# Altium schematic sheet Conning_Tower.SchDoc
size Tabloid; Organization: Altium Limited; Address1: L3, 12a Rodborough Rd; Address2: Frenchs Forest; Address3: NSW; Address4: Australia 2086
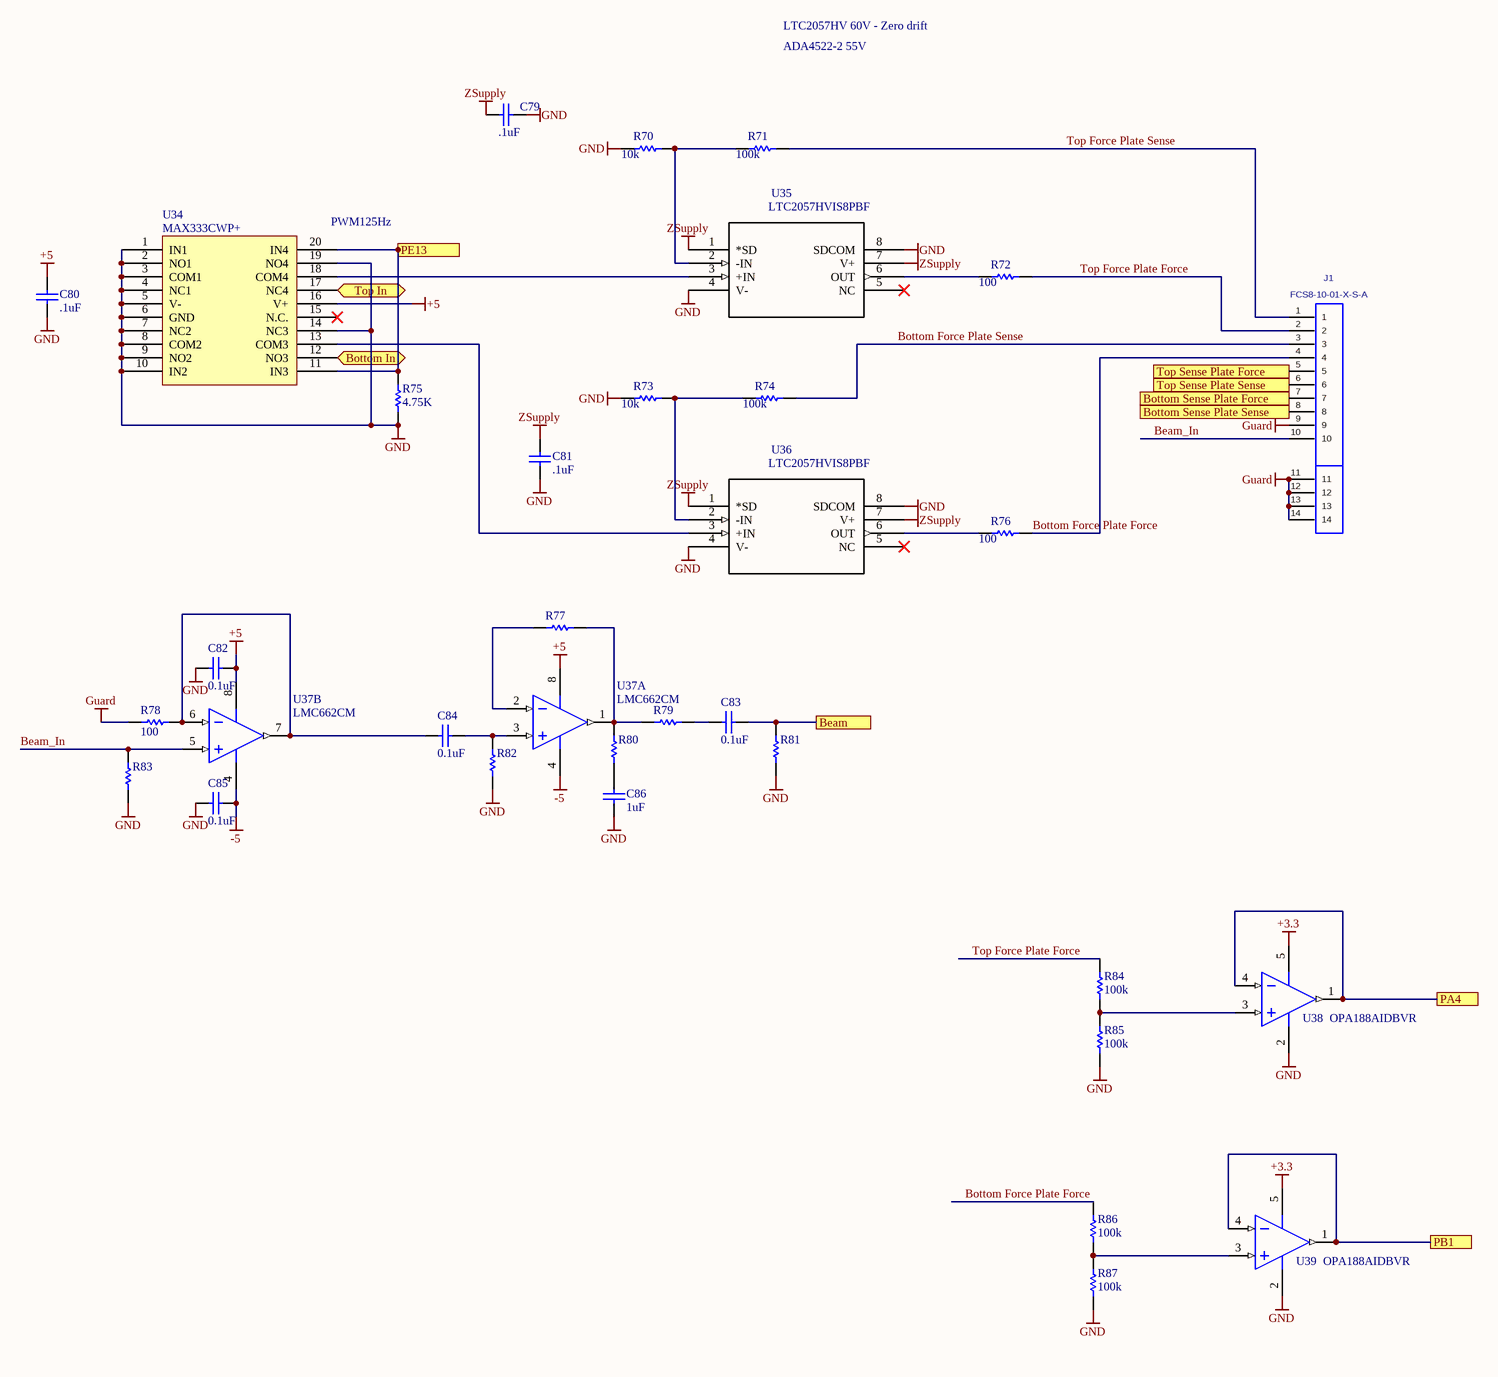
[diagram p0: Conning_Tower.SchDoc]

## Parts
C79  .1uF  [CAPC0805(2012)75_M]
C80  .1uF  [CAPC0805(2012)75_L]
C81  .1uF  [CAPC0805(2012)75_M]
C82  0.1uF  [CAPC0402(1005)60_L]
C83  0.1uF  [CAPC0402(1005)60_L]
C84  0.1uF  [CAPC0402(1005)60_L]
C85  0.1uF  [CAPC0402(1005)60_L]
C86  1uF  [CAPC0402(1005)60_L]
J1  FCS8-10-01-X-S-A  [FCS8-10-01-X-S-A]
R70  value 10k  [RESC0402(1005)_M]  (hidden comment: 10k 1% 0402(1005))
R71  value 100k  [RESC0402(1005)_M]  (hidden comment: 100k 1% 0402(1005))
R72  value 100  [RESC0402(1005)_M]  (hidden comment: 100 1% 0402(1005))
R73  value 10k  [RESC0402(1005)_M]  (hidden comment: 10k 1% 0402(1005))
R74  value 100k  [RESC0402(1005)_M]  (hidden comment: 100k 1% 0402(1005))
R75  4.75K  [RESC0805(2012)_L]
R76  value 100  [RESC0402(1005)_M]  (hidden comment: 100 1% 0402(1005))
R77  (no value)  [RESC0402(1005)_M]
R78  100  [RESC0402(1005)_M]
R79  (no value)  [RESC0402(1005)_M]
R80  (no value)  [RESC0402(1005)_M]
R81  (no value)  [RESC0402(1005)_M]
R82  (no value)  [RESC0402(1005)_M]
R83  (no value)  [RESC0402(1005)_M]
R84  value 100k  [RESC0402(1005)_M]  (hidden comment: 100k 1% 0402(1005))
R85  value 100k  [RESC0402(1005)_M]  (hidden comment: 100k 1% 0402(1005))
R86  value 100k  [RESC0402(1005)_M]  (hidden comment: 100k 1% 0402(1005))
R87  value 100k  [RESC0402(1005)_M]  (hidden comment: 100k 1% 0402(1005))
U34  MAX333CWP+  [TSOP65P640X90-20N]
U35  LTC2057HVIS8PBF  [*SO-8_S]
U36  LTC2057HVIS8PBF  [*SO-8_S]
U37  LMC662CM  [D0008A_M]  (parts A,B of 2)
U38  OPA188AIDBVR  [DBV0005A_M]
U39  OPA188AIDBVR  [DBV0005A_M]

## Ports
Beam, Bottom In (bidir), Bottom Sense Plate Force, Bottom Sense Plate Sense, PA4, PB1, PE13, Top In (bidir), Top Sense Plate Force, Top Sense Plate Sense

## Nets
+3.3: U38.5(V+) U39.5(V+)
+5: C80.2 C82.2 U34.16(V+) U37.8(V+)
-5: C85.2 U37.4(V-)
GND: C79.2 C80.1 C81.1 C82.1 C85.1 C86.1 R70.1 R73.1 R75.2 R81.2 R82.2 R83.1 R85.1 R87.1 U34.1(IN1) U34.2(NO1) U34.3(COM1) U34.4(NC1) U34.5(V-) U34.6(GND) U34.7(NC2) U34.8(COM2) U34.9(NO2) U34.10(IN2) U34.14(NC3) U34.19(NO4) U35.4(V-) U35.8(SDCOM) U36.4(V-) U36.8(SDCOM) U38.2(V-) U39.2(V-)
Guard: J1.9 J1.11 J1.12 J1.13 J1.14 R78.2
ZSupply: C79.1 C81.2 U35.1(*SD) U35.7(V+) U36.1(*SD) U36.7(V+)
Beam: C83.2 R81.1 ; port Beam
Beam_In: J1.10 R83.2 U37.5(INB+)
Bottom Force Plate Force: J1.4 R76.2 R86.2
Bottom Force Plate Sense: J1.3 R74.2
Bottom In: U34.12(NO3) ; port Bottom In
Bottom Sense Plate Force: J1.7 ; port Bottom Sense Plate Force
Bottom Sense Plate Sense: J1.8 ; port Bottom Sense Plate Sense
PA4: U38.1(OUT) U38.4(IN-) ; port PA4
PB1: U39.1(OUT) U39.4(IN-) ; port PB1
PE13: R75.1 U34.11(IN3) U34.20(IN4) ; port PE13
Top Force Plate Force: J1.2 R72.2 R84.2
Top Force Plate Sense: J1.1 R71.2
Top In: U34.17(NC4) ; port Top In
Top Sense Plate Force: J1.5 ; port Top Sense Plate Force
Top Sense Plate Sense: J1.6 ; port Top Sense Plate Sense
NetC83_1: C83.1 R79.1
NetC84_1: C84.1 R78.1 U37.6(INB-) U37.7(OUTB)
NetC84_2: C84.2 R82.1 U37.3(INA+)
NetC86_2: C86.2 R80.2
NetR70_2: R70.2 R71.1 U35.2(-IN)
NetR72_1: R72.1 U35.6(OUT)
NetR73_2: R73.2 R74.1 U36.2(-IN)
NetR76_1: R76.1 U36.6(OUT)
NetR77_1: R77.1 R79.2 R80.1 U37.1(OUTA)
NetR77_2: R77.2 U37.2(INA-)
NetR84_1: R84.1 R85.2 U38.3(IN+)
NetR86_1: R86.1 R87.2 U39.3(IN+)
NetU34_13: U34.13(COM3) U36.3(+IN)
NetU34_18: U34.18(COM4) U35.3(+IN)

Not connected (* = marked no-connect by the designer): U34 15(N.C.)*; U35 5(NC)*; U36 5(NC)*

## Notes on the sheet
- LTC2057HV 60V - Zero drift
- ADA4522-2 55V
- (near U34) PWM125Hz
- Title
- Size:
- Date:
- Tabloid
- Number:
- Time:
- Revision:
- Sheet
- of
- File:

## Library data of the parts
C79 C81 = CMP-1036-01414-1: CAP 33pF 25V ±2% 0805 (2012 Metric) Thickness 0.75mm SMD; Tolerance: Â±2%; Case-Metric: 2012; Case-EIA: 0805; Value: .1uF; Max Thickness: 0.75 mm; Rated Voltage: 25 V; Technology: SMT
C80 = CMP-1036-02117-1: CAP 150pF 16V ±10% 0805 (2012 Metric) Thickness 0.75mm SMD; Case-EIA: 0805; Tolerance: Â±10%; Case-Metric: 2012; Technology: SMT; Max Thickness: 0.75 mm; Rated Voltage: 16 V; Value: .1uF
C82-C86 = CMP-1034-00252-1: CAP CER 0.1UF 10V X7R 0402; Manufacturer: Murata Electronics North America; Manufacturer Part Number: GRM155R71A104KA01D; Tolerance: ±10%; Supplier 1: Digi-Key; Supplier Part Number 1: 490-6321-1-ND; RoHS: RoHS Compliant; Category: Capacitors; Stock 1: 2920395; Pricing 1: 1=0.1, 10=0.014, 100=0.0063, 500=0.00446, 1000=0.00351, 2500=0.00319, 5000=0.00293 (USD); Packaging: Cut Tape (CT); Part Status: Active; Voltage - Rated: 10V; Temperature Coefficient: X7R; Operating Temperature: -55°C ~ 125°C; Features: -; Ratings: -; Applications: General Purpose; Mounting Type: Surface Mount, MLCC; Package / Case: 0402 (1005 Metric); Size / Dimension: 0.039" L x 0.020" W (1.00mm x 0.50mm); Height - Seated (Max): -; Thickness (Max): 0.022" (0.55mm); Lead Spacing: -; ComponentLink1URL: http://www.murata.com/~/media/webrenewal/support/library/catalog/products/capacitor/mlcc/c02e.ashx?la=en-us; ComponentLink1Description: http://www.murata.com/~/media/webrenewal/support/library/catalog/products/capacitor/mlcc/c02e.ashx?la=en-us
J1 = FCS8-10-01-X-S-A: FCS8 Socket Assembly, 20-Pins, w/ Alignment Pins; MANUFACTURER: SAMTEC; CREATED: 31 NOV 2013 - WENDY XIN; PCB DECAL: FCS8-10-01-X-S-A
R70 R73 = CMP-1011-00940-1: 10k 0.063W 1% 0402 (1005 Metric)  SMD; Case-Metric: 1005; Case-EIA: 0402; Power: 0.063 W; Technology: SMT; Tolerance: 1 %
R71 R74 R84-R87 = CMP-1011-00940-1: 100k 0.063W 1% 0402 (1005 Metric)  SMD; Case-Metric: 1005; Case-EIA: 0402; Power: 0.063 W; Technology: SMT; Tolerance: 1 %
R72 R76 = CMP-1011-00940-1: 6M34 0.063W 1% 0402 (1005 Metric)  SMD; Case-Metric: 1005; Case-EIA: 0402; Power: 0.063 W; Technology: SMT; Tolerance: 1 %
R75 = CMP-1013-00215-1: 2R55 0.125W 1% 0805 (2012 Metric)  SMD; Case-Metric: 2012; Value: 47k; Case-EIA: 0805; Tolerance: 1 %; Technology: SMT; Power: 0.125 W
R77-R83 = CMP-1011-00463-1
U34 = MAX333CWP+: IC SWITCH QUAD SPDT 20TSSOP; Manufacturer: Maxim; Manufacturer Part Number: MAX333AEUP+; Max Supply Voltage: 30V; Min Supply Voltage: 10V; Min Dual Supply Voltage: 4.5V; Max Dual Supply Voltage: 20V; On-State Resistance: 35R; Operating Supply Current: 1uA; Supply Type: Single,Dual; Max Power Dissipation: 559mW; Turn-On Delay Time: 175ns; Turn-Off Delay Time: 145ns; Max Supply Current: 250uA; Number of Bits: 4; Dual Supply Voltage: 15V; Supplier 1: Mouser; Supplier Part Number 1: 700-MAX333AEUP; Stock 1: 664; Pricing 1: 1=6.77, 10=6.43, 50=5.8, 100=5.8, 1000=5.62, 10000=5.62 (USD); Case/Package: TSSOP; Number of Pins: 20; Weight: 0.006737oz; Min Operating Temperature: -40°C; Max Operating Temperature: 85°C; Packaging: Rail/Tube; Package Quantity: 74; Throw Configuration: SPDT; Number of Channels: 4; Length: 6.6mm; Height: 0.95mm; Width: 4.5mm; Radiation Hardening: No; Lead Free: Lead Free; REACH SVHC: Unknown; ComponentLink1URL: https://datasheet.ciiva.com/2978/max333a-2978850.pdf; ComponentLink1Description: https://datasheet.ciiva.com/2978/max333a-2978850.pdf; ComponentLink2URL: https://datasheet.ciiva.com/30478/0900766b81253c85-30478260.pdf; ComponentLink2Description: https://datasheet.ciiva.com/30478/0900766b81253c85-30478260.pdf; ComponentLink3URL: https://datasheet.ciiva.com/1674/max333a-1674617.pdf; ComponentLink3Description: https://datasheet.ciiva.com/1674/max333a-1674617.pdf; ComponentLink4URL: https://datasheet.ciiva.com/26825/max333aeup-26825546.pdf; ComponentLink4Description: https://datasheet.ciiva.com/26825/max333aeup-26825546.pdf
U35 U36 = LTC2057HVIS8PBF: LTC2057/LTC2057HV - High Voltage, Low Noise Zero-Drift Operational Amplifier; Manufacturer: Analog Devices / Linear Technology; MF: Linear Technology/Analog; MP: LTC2057HVIS8#PBF; Number of Channels: 1; Common Mode Rejection Ratio: 128dB; Unity Gain Bandwidth Product: 1.5MHz; Max Supply Voltage: 60V; Min Supply Voltage: 4.75V; Slew Rate: 0.45V/µs; Input Bias Current: 30pA; Input Offset Voltage (Vos): 0.5uV; Operating Supply Current: 900uA; Output Current per Channel: 30mA; Voltage Gain: 150dB; Digi-Key_Part_Number: LTC2057HVIS8#PBF-ND; SnapEDA_Link: https://www.snapeda.com/parts/LTC2057HVIS8%23PBF/Analog%20Devices/view-part/?ref=snap; Package: SO-8 Linear Technology; Digi-Key_Purchase_URL: https://www.digikey.com/product-detail/en/linear-technology-analog-devices/LTC2057HVIS8-PBF/LTC2057HVIS8-PBF-ND/4156547?utm_source=snapeda&utm_medium=aggregator&utm_campaign=symbol; Value: *; Supplier 1: Mouser; Supplier Part Number 1: 584-LTC2057HVIS8#PBF; Manufacturer Part Number: LTC2057HVIS8#PBF; Stock 1: 880; Pricing 1: 1=5.30000, 10=5.30000, 25=3.51000, 50=3.51000, 100=2.90000, 250=2.76000, 500=2.70000, 1000=2.59000, 10000=2.59000 (USD); RoHS: Yes; Mount: Surface Mount; Case/Package: SOIC; Number of Pins: 8; Min Operating Temperature: -40°C; Max Operating Temperature: 85°C; Bandwidth: 1.5MHz; Package Quantity: 100; Packaging: Rail/Tube; Number of Circuits: 1; Gain Bandwidth Product: 1.5MHz; Number of Elements: 1; Number of Amplifiers: 1; REACH SVHC: No SVHC; ComponentLink1URL: https://datasheet.ciiva.com/18622/43236-18622326.pdf?src-supplier=Digi-Key; ComponentLink1Description: https://datasheet.ciiva.com/18622/43236-18622326.pdf?src-supplier=Digi-Key; ComponentLink2URL: https://datasheet.ciiva.com/22733/1761439-22733480.pdf?src-supplier=Element14; ComponentLink2Description: https://datasheet.ciiva.com/22733/1761439-22733480.pdf?src-supplier=Element14; ComponentLink3URL: https://datasheet.ciiva.com/25651/1761439-25651631.pdf?src-supplier=Farnell; ComponentLink3Description: https://datasheet.ciiva.com/25651/1761439-25651631.pdf?src-supplier=Farnell
U37 = CMP-0055-00893-3: CMOS Dual Operational Amplifier, 8-pin Narrow SOIC; Manufacturer: Texas Instruments; PowerWise: N; CompType: Amplifiers; PackageTopMarking: NSZXTT*LMC66*2CM; RoHS: N; ComponentLink1Description: Datasheet URL; PinCount: 8; Code_IPC: SOIC127P600-8; ComponentLink1URL: http://www.ti.com/general/docs/lit/getliterature.tsp?genericPartNumber=LMC662&fileType=pdf; Code_JEDEC: MS-012-AA; PackageDescription: SOIC Narrow, 4.9 x 3.9 x 1.45mm, 8 Lead, 1.27mm Pitch; Package Reference: D0008A; PartId: 1
U38 U39 = CMP-0809-00005-2: Precision, Low Noise, Rail-to-Rail Output, Zero-Drift Operational Amplifier, 4 to 36 V, -40 to 125 degC, 5-pin SOT23 (DBV5), Green (RoHS & no Sb/Br); Manufacturer: Texas Instruments; Total Supply Voltage(Min)(+5V is 5, +/-5V is 10): 4; Offset Drift(Typ)(uV/C): 0.03; Rating: Catalog; SubFamily: Zero Drift Precision Amplifier; GBW(Typ)(MHz): 2; Slew Rate(Typ)(V/us): 0.8; Number of Channels: 1; CMRR(Min)(dB): 120; Iq per channel(Max)(mA): 0.51; Total Supply Voltage(Max)(+5V is 5, +/-5V is 10): 36; PartNumber: OPA188AIDBVR; ComponentLink2Description: Datasheet; ComponentLink2URL: http://www.ti.com/lit/ds/symlink/opa188.pdf; ComponentLink1Description: Manufacturer URL; Mounting Technology: Surface Mount; Eco-Plan: Green (RoHS & no Sb/Br); ComponentLink1URL: http://www.ti.com/; PackageVersion: 4073253-4/K, 03/2006; DatasheetVersion: SBOS642A; ComponentLink3Description: Package Specification; PackageReference: DBV0005A; ComponentLink3URL: http://www.ti.com/litv/pdf/mpds018i; PackageDescription: 5-Pin Plastic Small Outline, Body 1.6 x 2.9 mm, Pitch 0.95 mm; Code_JEDEC: MO-178